# Altium schematic sheet WholeAdder.SchDoc
size A0
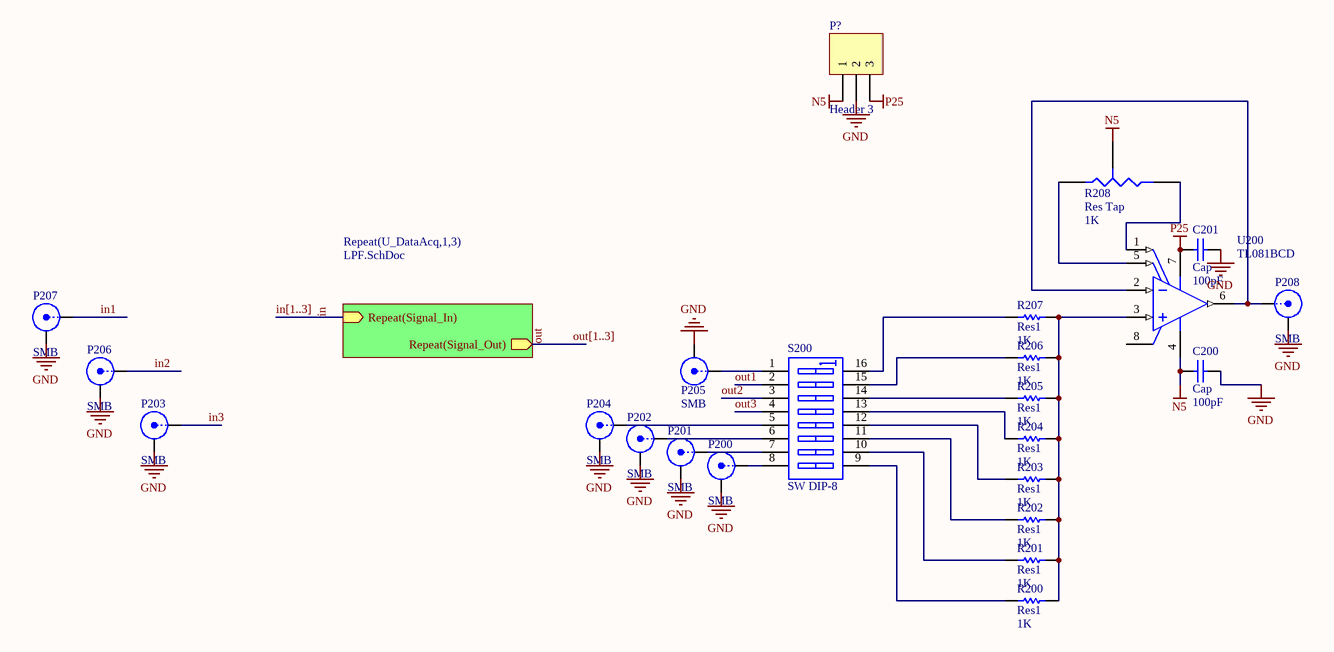
[diagram p0: WholeAdder.SchDoc]

## Parts
C200  Cap  value 100pF  [CAPC1608N]
C201  Cap  value 100pF  [CAPC1608N]
P200  SMB  [SMB_V-RJ45]
P201  SMB  [SMB_V-RJ45]
P202  SMB  [SMB_V-RJ45]
P203  SMB  [SMB_V-RJ45]
P204  SMB  [SMB_V-RJ45]
P205  SMB  [SMB_V-RJ45]
P206  SMB  [SMB_V-RJ45]
P207  SMB  [SMB_V-RJ45]
P208  SMB  [SMB_V-RJ45]
P?  Header 3  [HDR1X3]
R200  Res1  value 1K  [RESC1608N]
R201  Res1  value 1K  [RESC1608N]
R202  Res1  value 1K  [RESC1608N]
R203  Res1  value 1K  [RESC1608N]
R204  Res1  value 1K  [RESC1608N]
R205  Res1  value 1K  [RESC1608N]
R206  Res1  value 1K  [RESC1608N]
R207  Res1  value 1K  [RESC1608N]
R208  Res Tap  value 1K  [HDR1X3]
S200  SW DIP-8  [DIP-16]
U200  TL081BCD  [TI-D8_N]

## Sub-sheets
Repeat(U_DataAcq,1,3) = LPF.SchDoc: Repeat(Signal_Out) (out), Repeat(Signal_In) (in)

## Nets
GND: C200.1 C201.1 P200.2(Y) P201.2(Y) P202.2(Y) P203.2(Y) P204.2(Y) P205.2(Y) P206.2(Y) P207.2(Y) P208.2(Y) P?.2
N5: C200.2 P?.1 R208.3(TAP) U200.4(VCC-)
P25: C201.2 P?.3 U200.7(VCC+)
in: sheet Repeat(U_DataAcq,1,3)/Repeat(Signal_In)
in1: P207.1(X)
in2: P206.1(X)
in3: P203.1(X)
out: sheet Repeat(U_DataAcq,1,3)/Repeat(Signal_Out)
out1: S200.2(A2)
out2: S200.3(A3)
out3: S200.4(A4)
NetP200_1: P200.1(X) S200.8(A8)
NetP201_1: P201.1(X) S200.7(A7)
NetP202_1: P202.1(X) S200.6(A6)
NetP204_1: P204.1(X) S200.5(A5)
NetP205_1: P205.1(X) S200.1(A1)
NetP208_1: P208.1(X) U200.2(IN-) U200.6(OUT)
NetR200_1: R200.1 S200.9(B8)
NetR200_2: R200.2 R201.2 R202.2 R203.2 R204.2 R205.2 R206.2 R207.2 U200.3(IN+)
NetR201_1: R201.1 S200.10(B7)
NetR202_1: R202.1 S200.11(B6)
NetR203_1: R203.1 S200.12(B5)
NetR204_1: R204.1 S200.13(B4)
NetR205_1: R205.1 S200.14(B3)
NetR206_1: R206.1 S200.15(B2)
NetR207_1: R207.1 S200.16(B1)
NetR208_1: R208.1(A) U200.5(OFFSET_N2)
NetR208_2: R208.2(B) U200.1(OFFSET_N1)

Not connected (* = marked no-connect by the designer): U200 8(NC)

## Buses and harness runs
bus in[1..3]
bus out[1..3]

## Library data of the parts
C200 C201 = Cap: Capacitor; Published: 8-Jun-2000; LatestRevisionDate: 17-Jul-2002; LatestRevisionNote: Re-released for DXP Platform.; PackageReference: RAD-0.3; Publisher: Altium Limited; PackageDescription: Radial Cap, Thru-Hole; 2 Leads; 0.3 in Pin Spacing
P200-P208 = SMB: SMB Straight Connector; LatestRevisionDate: 17-Jul-2002; LatestRevisionNote: Re-released for DXP Platform.; Publisher: Altium Limited
P? = Header 3: Header, 3-Pin; LatestRevisionDate: 17-Jul-2002; LatestRevisionNote: Re-released for DXP Platform.; Publisher: Altium Limited
R200-R207 = Res1: Resistor; Published: 8-Jun-2000; LatestRevisionDate: 17-Jul-2002; LatestRevisionNote: Re-released for DXP Platform.; PackageReference: AXIAL-0.3; Publisher: Altium Limited; PackageDescription: Axial Device, Thru-Hole; 2 Leads; 0.3 in Pin Spacing
R208 = Res Tap: Tapped Resistor; pin to pad: 2>3 3>2; Sim Note: Enter the Resistance value and the set point into parameter fields.; Set Position: 0.5; Published: 24-Mar-1999; LatestRevisionDate: 17-Jul-2002; LatestRevisionNote: Re-released for DXP Platform.; PackageReference: VR3; Publisher: Altium Limited; PackageDescription: Variable Resistor, Thru-Hole; 3 Leads
S200 = SW DIP-8: DIP Switch, 8 Position, SPST; Published: 24-Mar-1999; LatestRevisionDate: 17-Jul-2002; LatestRevisionNote: Re-released for DXP Platform.; PackageReference: DIP_SW_8WAY_SMD; Publisher: Altium Limited; PackageDescription: DIP Switch; 16 Leads
U200 = TL081BCD: JFET-Input Operational Amplifier, 7 to 36 V, 0 to 70 degC, 8-pin SOIC (D8), Green (RoHS & no Sb/Br); Manufacturer: Texas Instruments; CMRR(Min)(dB): 75; GBW(Typ)(MHz): 3; IIB(Max)(pA): 200; Iq per channel(Max)(mA): 2.8; Number of Channels: 1; Offset Drift(Typ)(uV/C): 18; Rating: Catalog; Slew Rate(Typ)(V/us): 13; Sub Family: General Purpose Amplifier, High Supply Voltage Amplifier (>=30V); Total Supply Voltage(Max)(+5V is 5, +/-5V is 10): 36; Total Supply Voltage(Min)(+5V is 5, +/-5V is 10): 7; DatasheetVersion: SLOS081G; PackageVersion: 4040047-3/M, 06/2011; PackageReference: D8; PackageDescription: 8-Pin Plastic Small Outline, Body 4.9 x 3.9 mm, Pitch 1.27 mm; Supplier 1: Digi-Key; Supplier Part Number 1: 296-34259-5-ND; Supplier 2: Farnell; Supplier Part Number 2: 1459710; Supplier 3: Newark; Supplier Part Number 3: 62M0593; Supplier 4: Newark; Supplier Part Number 4: 76C9117; Supplier 5: Mouser; Supplier Part Number 5: 595-TL081BCD; Eco-Plan: Green (RoHS & no Sb/Br); Vio (25C)(Max)(mV): 3; Vn at 1kHz(Typ)(nV/rtHz): 18; Mounting Technology: Surface Mount; Code_JEDEC: MS-012; PartNumber: TL081BCD; ComponentLink1Description: Manufacturer URL; ComponentLink1URL: http://www.ti.com/; ComponentLink2Description: Datasheet; ComponentLink2URL: http://www.ti.com/lit/ds/symlink/tl081b.pdf; ComponentLink3Description: Package Specification; ComponentLink3URL: http://www.ti.com/litv/pdf/msoi002j